# EAGLE schematic komparator (EAGLE 6.6.0)
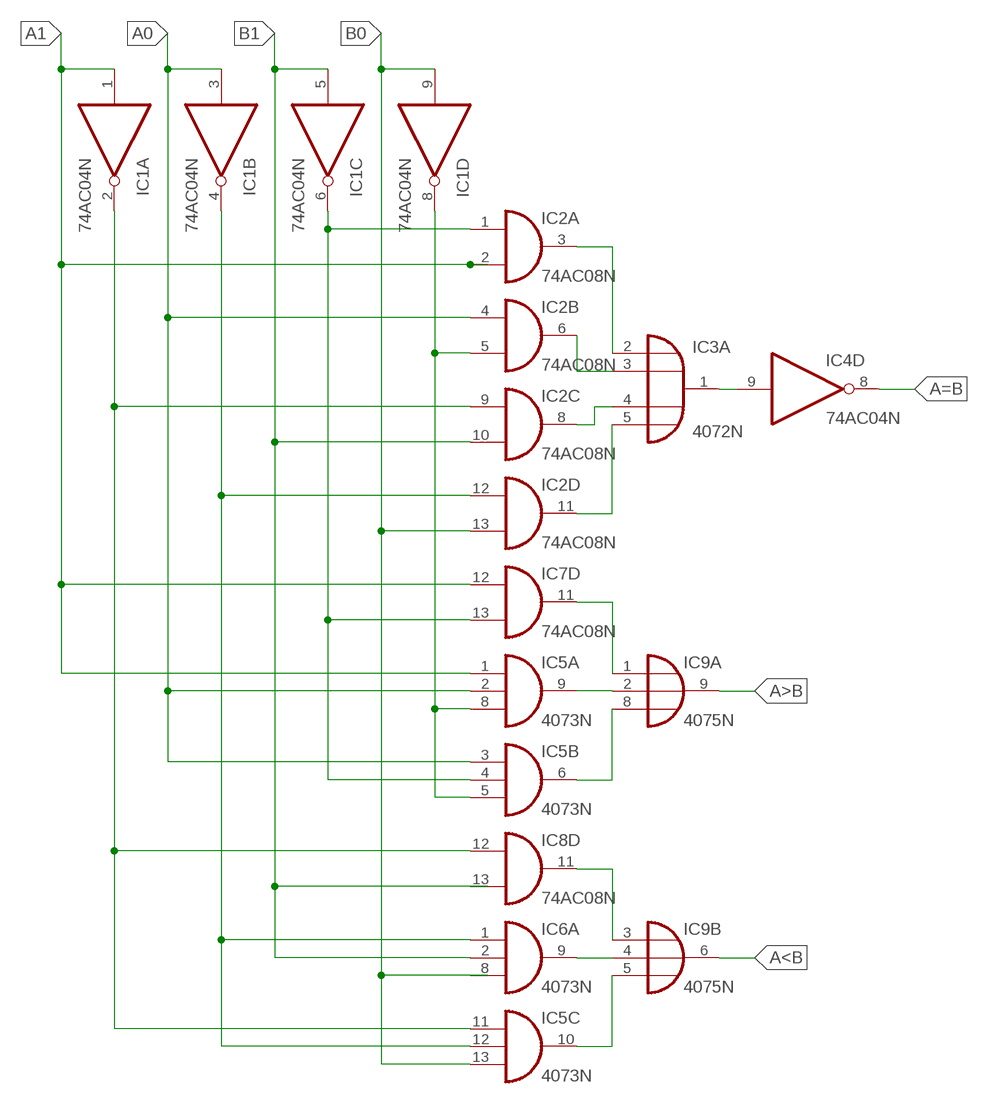
[diagram p0: schematic, sheet 1]

## Parts
IC1  74AC04N  [DIL14]
IC2  74AC08N  [DIL14]
IC3  4072N  [DIL14]
IC4  74AC04N  [DIL14]
IC5  4073N  [DIL14]
IC6  4073N  [DIL14]
IC7  74AC08N  [DIL14]
IC8  74AC08N  [DIL14]
IC9  4075N  [DIL14]

## Nets
A0: IC1.3(B:I) IC2.4(B:I0) IC5.2(A:I1) IC5.3(B:I0)
A1: IC1.1(A:I) IC2.2(A:I1) IC5.1(A:I0) IC7.12(D:I0)
A<B: IC9.6(B:O)
A=B: IC4.8(D:O)
A>B: IC9.9(A:O)
B0: IC1.9(D:I) IC2.13(D:I1) IC5.13(C:I2)
B1: IC1.5(C:I) IC2.10(C:I1) IC6.2(A:I1)
N$1: IC2.3(A:O) IC3.2(A:I0)
N$2: IC1.2(A:O) IC2.9(C:I0) IC5.11(C:I0) IC8.12(D:I0)
N$3: IC2.6(B:O) IC3.3(A:I1)
N$4: IC1.4(B:O) IC2.12(D:I0) IC5.12(C:I1) IC6.1(A:I0)
N$5: IC2.11(D:O) IC3.5(A:I3)
N$6: IC1.6(C:O) IC2.1(A:I0) IC5.4(B:I1) IC7.13(D:I1)
N$7: IC1.8(D:O) IC2.5(B:I1) IC5.5(B:I2) IC5.8(A:I2)
N$8: IC2.8(C:O) IC3.4(A:I2)
N$9: IC3.1(A:O) IC4.9(D:I)
N$10: IC5.6(B:O) IC9.8(A:I2)
N$11: IC5.9(A:O) IC9.2(A:I1)
N$12: IC7.11(D:O) IC9.1(A:I0)
N$13: IC6.9(A:O) IC9.4(B:I1)
N$14: IC8.11(D:O) IC9.3(B:I0)
N$15: IC5.10(C:O) IC9.5(B:I2)
Unconnected: IC1.10(E:O) IC1.11(E:I) IC1.12(F:O) IC1.13(F:I) IC3.9(B:I0) IC3.10(B:I1) IC3.11(B:I2) IC3.12(B:I3) IC3.13(B:O) IC4.1(A:I) IC4.2(A:O) IC4.3(B:I) IC4.4(B:O) IC4.5(C:I) IC4.6(C:O) IC4.10(E:O) IC4.11(E:I) IC4.12(F:O) IC4.13(F:I) IC6.3(B:I0) IC6.4(B:I1) IC6.5(B:I2) IC6.6(B:O) IC6.8(A:I2) IC6.10(C:O) IC6.11(C:I0) IC6.12(C:I1) IC6.13(C:I2) IC7.1(A:I0) IC7.2(A:I1) IC7.3(A:O) IC7.4(B:I0) IC7.5(B:I1) IC7.6(B:O) IC7.8(C:O) IC7.9(C:I0) IC7.10(C:I1) IC8.1(A:I0) IC8.2(A:I1) IC8.3(A:O) IC8.4(B:I0) IC8.5(B:I1) IC8.6(B:O) IC8.8(C:O) IC8.9(C:I0) IC8.10(C:I1) IC8.13(D:I1) IC9.10(C:O) IC9.11(C:I0) IC9.12(C:I1) IC9.13(C:I2)

## Power pins joined to a net without a drawn wire
GND: IC1.7(P:GND) IC2.7(P:GND) IC4.7(P:GND) IC7.7(P:GND) IC8.7(P:GND)
VCC: IC1.14(P:VCC) IC2.14(P:VCC) IC4.14(P:VCC) IC7.14(P:VCC) IC8.14(P:VCC)
VDD: IC3.14(P:VDD) IC5.14(P:VDD) IC6.14(P:VDD) IC9.14(P:VDD)
VSS: IC3.7(P:VSS) IC5.7(P:VSS) IC6.7(P:VSS) IC9.7(P:VSS)

## Library data of the parts
IC1 IC4 = 74xx-eu:74*04: Hex INVERTER
IC2 IC7 IC8 = 74xx-eu:74*08: Quad 2-input AND gate
IC3 = 40xx:4072: Dual 4-input OR
IC5 IC6 = 40xx:4073: Triple 3-input AND
IC9 = 40xx:4075: Triple 3-input OR